# EAGLE design Qwiic_Spectral_Sensor-AS7265x-BottomJig (EAGLE 9.2.1)
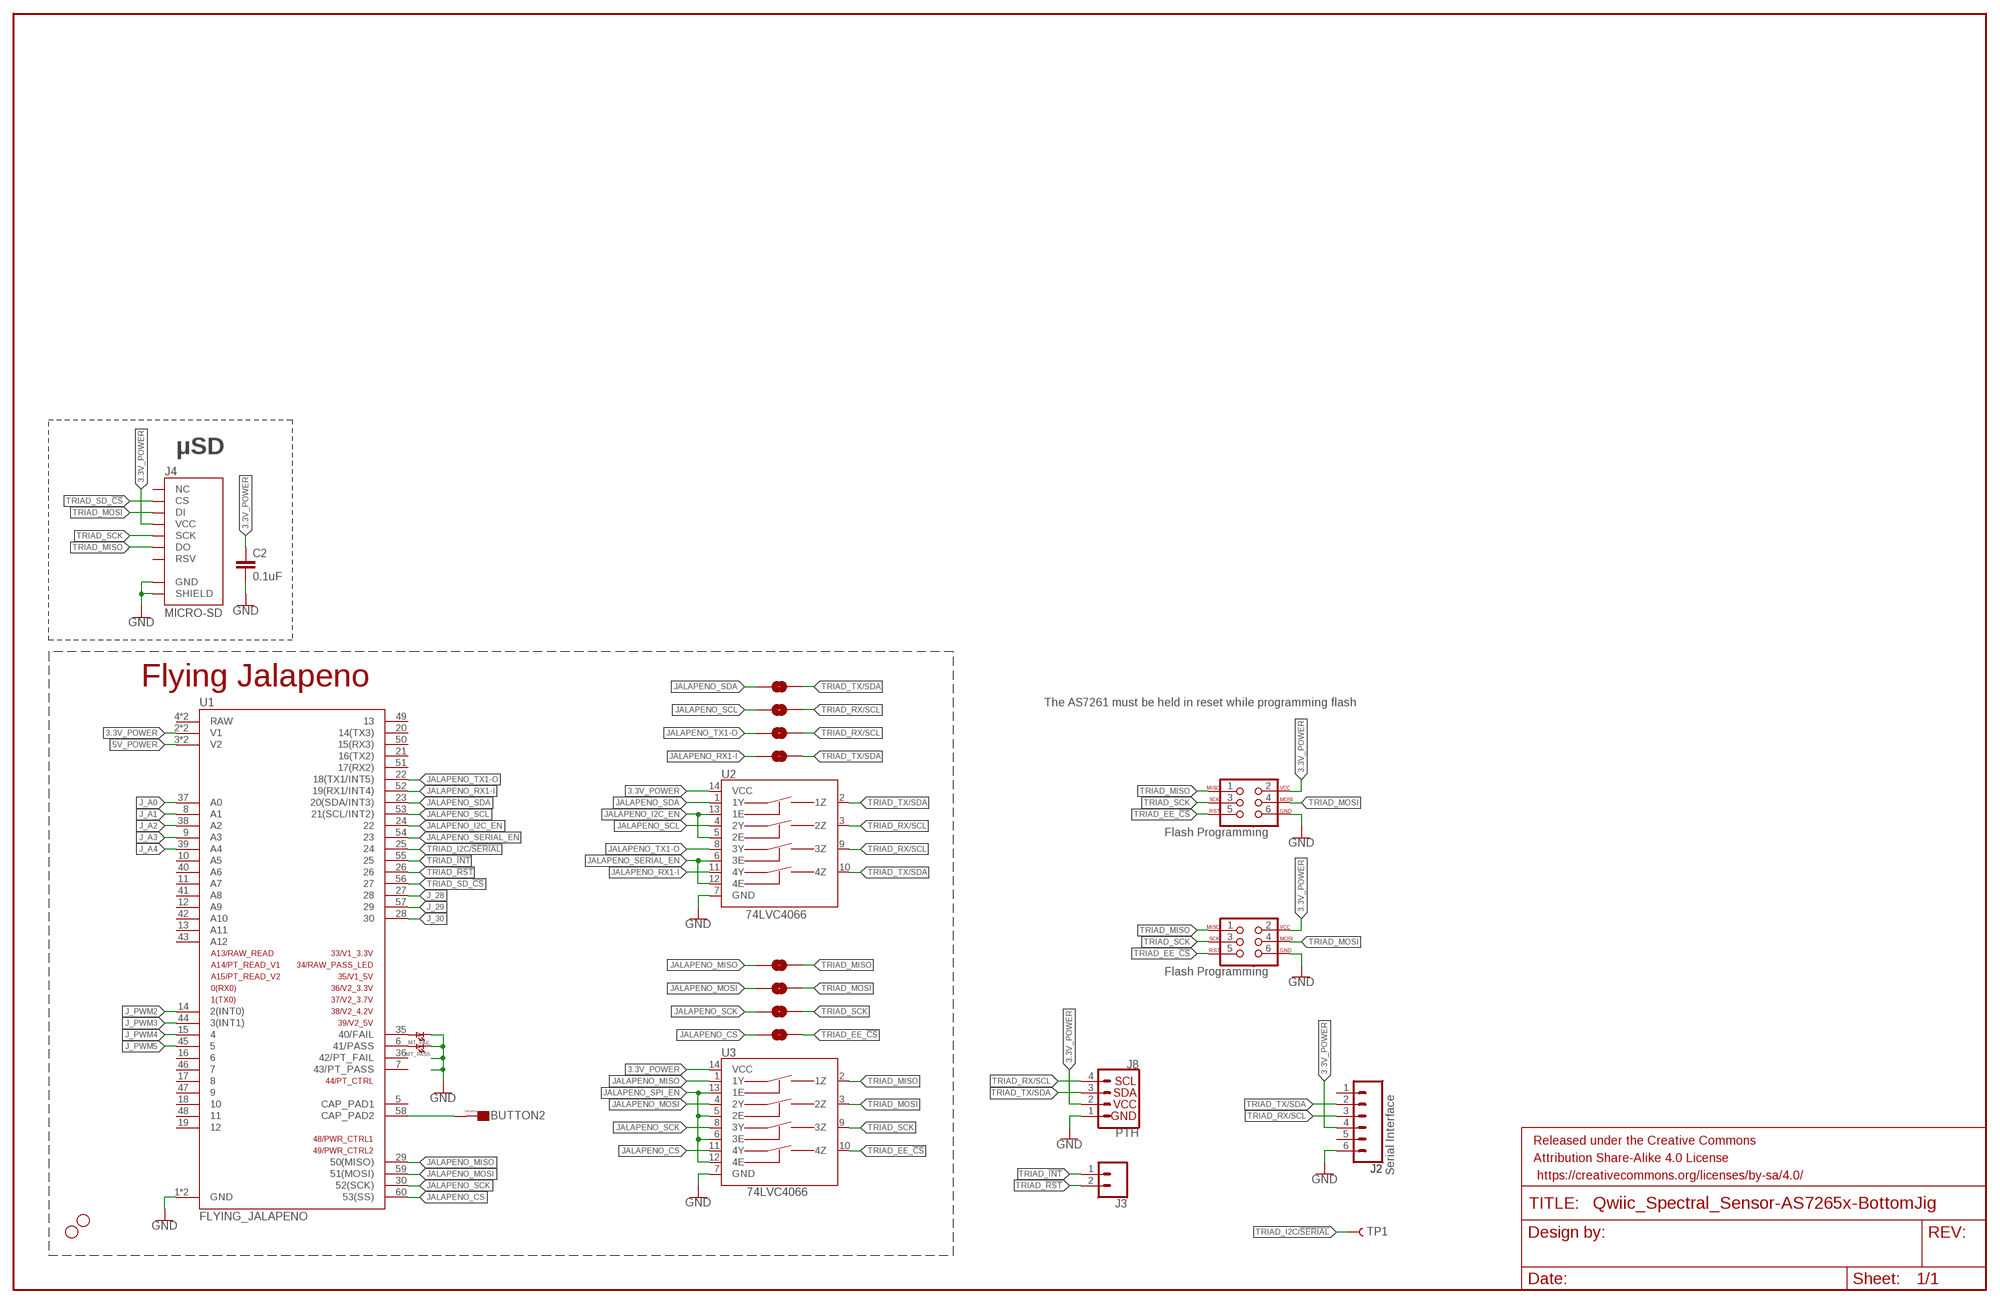
[diagram p0: schematic, sheet 1]

## Parts
BUTTON2  CAPSENSE_BUTTON_PAD_ONLY  [CAPSENSE_BUTTON_PADS_ONLY]
C2  0.1uF  0.1UF-0603-25V-(+80/-20%)  [0603]
FRAME2  FRAME-LEDGER  [CREATIVE_COMMONS]
H1  STAND-OFF  [STAND-OFF]
H3  STAND-OFF  [STAND-OFF]
J1  Flash Programming  AVR_SPI_PROG_3X2NS  [2X3-NS]
J2  Serial Interface  CONN_06NO_SILK_FEMALE_PTH  [1X06_NO_SILK]
J3  CONN_021X02_NO_SILK  [1X02_NO_SILK]
J4  MICRO-SD  MICRO-SD_CARD_SOCKETPUSH-PUSH  [MICRO-SD-SOCKET]
J5  Flash Programming  AVR_SPI_PROG_3X2NS  [2X3-NS]
J8  PTH  I2C_STANDARD_NO_SILK  [1X04_NO_SILK]
J_SCL  JUMPER-SMT_2_NO_NO-SILK  [SMT-JUMPER_2_NO_NO-SILK]
J_SCL1  JUMPER-SMT_2_NO_NO-SILK  [SMT-JUMPER_2_NO_NO-SILK]
J_SCL2  JUMPER-SMT_2_NO_NO-SILK  [SMT-JUMPER_2_NO_NO-SILK]
J_SCL3  JUMPER-SMT_2_NO_NO-SILK  [SMT-JUMPER_2_NO_NO-SILK]
J_SCL4  JUMPER-SMT_2_NO_NO-SILK  [SMT-JUMPER_2_NO_NO-SILK]
J_SCL5  JUMPER-SMT_2_NO_NO-SILK  [SMT-JUMPER_2_NO_NO-SILK]
J_SDA  JUMPER-SMT_2_NO_NO-SILK  [SMT-JUMPER_2_NO_NO-SILK]
J_SDA1  JUMPER-SMT_2_NO_NO-SILK  [SMT-JUMPER_2_NO_NO-SILK]
MT_FAIL  LED1206  [LED-1206]
MT_PASS  LED1206  [LED-1206]
TP1  TEST-POINTPOGO_PTH  [1X01_NO_SILK]
U1  FLYING_JALAPENO  FLYING_JALAPENO_V3MALE  [FLYING_JALAPENO_V3_M]
U2  74LVC4066  74LVC4066_MUX_1:1_X4  [SO14]
U3  74LVC4066  74LVC4066_MUX_1:1_X4  [SO14]

## Nets
3.3V_POWER [VCC]: C2.1 J1.2 J2.4 J4.VCC J5.2 J8.2 U1.2(V1) U1.32(V1) U2.14(VCC) U3.14(VCC)
5V_POWER [POWA]: U1.3(V2) U1.33(V2)
BUTTON2 [CAPSENSE]: BUTTON2.CAPSENSE_PAD(CAPSENSE) U1.58(CAP_PAD2)
GND: C2.2 J1.6 J2.6 J4.CD1(SHIELD) J4.GND J5.6 J8.1 MT_FAIL.C MT_PASS.C U1.1(GND) U1.31(GND) U2.7(GND) U3.7(GND)
J_28: U1.27
J_29: U1.57
J_30: U1.28
J_A0: U1.37(A0)
J_A1: U1.8(A1)
J_A2: U1.38(A2)
J_A3: U1.9(A3)
J_A4: U1.39(A4)
J_PWM2: U1.14(2(INT0))
J_PWM3: U1.44(3(INT1))
J_PWM4: U1.15
J_PWM5: U1.45
JALAPENO_CS: J_SDA1.1 U1.60(53(SS)) U3.11(4Y)
JALAPENO_I2C_EN: U1.24 U2.5(2E) U2.13(1E)
JALAPENO_MISO: J_SCL5.1 U1.29(50(MISO)) U3.1(1Y)
JALAPENO_MOSI: J_SCL3.1 U1.59(51(MOSI)) U3.4(2Y)
JALAPENO_RX1-I: J_SDA.1 U1.52(19(RX1/INT4)) U2.11(4Y)
JALAPENO_SCK: J_SCL4.1 U1.30(52(SCK)) U3.8(3Y)
JALAPENO_SCL: J_SCL.1 U1.53(21(SCL/INT2)) U2.4(2Y)
JALAPENO_SDA: J_SCL2.1 U1.23(20(SDA/INT3)) U2.1(1Y)
JALAPENO_SERIAL_EN: U1.54 U2.6(3E) U2.12(4E)
JALAPENO_SPI_EN: U3.5(2E) U3.6(3E) U3.12(4E) U3.13(1E)
JALAPENO_TX1-O: J_SCL1.1 U1.22(18(TX1/INT5)) U2.8(3Y)
N$15: MT_PASS.A U1.6(41/PASS)
N$16: MT_FAIL.A U1.35(40/FAIL)
TRIAD_!INT!: J3.1 U1.55
TRIAD_!RST!: J3.2 U1.26
TRIAD_EE_!CS!: J1.5 J5.5 J_SDA1.2 U3.10(4Z)
TRIAD_I2C/!SERIAL!: TP1.1 U1.25
TRIAD_MISO: J1.1 J4.DO J5.1 J_SCL5.2 U3.2(1Z)
TRIAD_MOSI: J1.4 J4.DI J5.4 J_SCL3.2 U3.3(2Z)
TRIAD_RX/SCL: J2.3 J8.4 J_SCL1.2 J_SCL.2 U2.3(2Z) U2.9(3Z)
TRIAD_SCK: J1.3 J4.SCLK(SCK) J5.3 J_SCL4.2 U3.9(3Z)
TRIAD_SD_!CS!: J4.CS U1.56
TRIAD_TX/SDA: J2.2 J8.3 J_SCL2.2 J_SDA.2 U2.2(1Z) U2.10(4Z)
Unconnected: J2.1 J2.5 J4.RSV1(RSV) J4.RSV2(NC) U1.4(RAW) U1.5(CAP_PAD1) U1.7(43/PT_PASS) U1.10(A5) U1.11(A7) U1.12(A9) U1.13(A11) U1.16 U1.17 U1.18 U1.19 U1.20(14(TX3)) U1.21(16(TX2)) U1.34(RAW) U1.36(42/PT_FAIL) U1.40(A6) U1.41(A8) U1.42(A10) U1.43(A12) U1.46 U1.47 U1.48 U1.49 U1.50(15(RX3)) U1.51(17(RX2))

## Notes on the sheet
- μSD
- Flying Jalapeno
- The AS7261 must be held in reset while programming flash

## Library data of the parts
BUTTON2 = Testing:CAPSENSE_BUTTON_PAD_ONLY
C2 = SparkFun-Capacitors:0.1UF: 0.1µF ceramic capacitors A capacitor is a passive two-terminal electrical component used to store electrical energy temporarily in an electric field.; PROD_ID: CAP-00810
FRAME2 = SparkFun-Aesthetics:FRAME-LEDGER: Schematic Frame - Ledger Standard 11x14 US Ledger frame
H1 H3 = SparkFun-Hardware:STAND-OFF: Stand Off Drill holes for mechanically mounting via screws, standoffs, etc. Note: Use the keepout ring to avoid running the screw head into surrounding components. Variant Overviews STAND-OFF - Mechanical footprint for a #4 phillips button head screw. STAND-OFF-TIGHT - Mechanical footprint for a #4 phillips button head screw, Example SparkFun Products Screw - Phillips Head (1/4", 4-40, 10 pack) <https://www.sparkfun.com/products/10453> (PRT-10453) Screw - Phillips Head (1/2", 4-40, 10 pack) <https://www.sparkfun.com/products/10452> (PRT-10452) Screw - Phillips Head (3/4", 4-40, 10 pack) <https://www.sparkfun.com/products/10451> (PRT-10451) Screw - Phillips Head (1", 4-40, 10 pack) <https://www.sparkfun.com/products/10450> (PRT-10450)
J1 J5 = SparkFun-Connectors:AVR_SPI_PROG_3X2: AVR ISP 6 Pin This is the reduced ISP connector for AVR programming. Common on Arduino. This footprint will take up less PCB space and can be used with a 10-pin to 6-pin adapter such as SKU: BOB-08508 **Special note about "TEST_POINT" package. The stop mask is on the top side, so if you want your programming test points to be on the bottom of your board, make sure to place this package on the bottom side of the board. This also ensure that the orientation to program from the bottom side will be correct. SparkFun Products: SparkFun ISP Pogo Adapter <https://www.sparkfun.com/products/11591> - NS Tiny AVR Programmer <https://www.sparkfun.com/products/11801> -PTH
J2 = SparkFun-Connectors:CONN_06: Multi connection point. Often used as Generic Header-pin footprint for 0.1 inch spaced/style header connections On any of the 0.1 inch spaced packages, you can populate with these: Break Away Headers - Straight <https://www.sparkfun.com/products/116> (PRT-00116) Break Away Male Headers - Right Angle <https://www.sparkfun.com/products/553> (PRT-00553) Female Headers <https://www.sparkfun.com/products/115> (PRT-00115) Break Away Headers - Machine Pin <https://www.sparkfun.com/products/117> (PRT-00117) Break Away Female Headers - Swiss Machine Pin <https://www.sparkfun.com/products/743> (PRT-00743) Arduino Stackable Header - 6 Pin <https://www.sparkfun.com/products/9280> (PRT-09280) For SCREWTERMINALS and SPRING TERMINALS visit here: Screw Terimnals on SparkFun.com <https://www.sparkfun.com/search/results?term=Screw+Terminals> (5mm/3.5mm/2.54mm spacing) This device is also useful as a general connection point to wire up your design to another part of your project. Our various solder wires solder well into these plated through hole pads. Hook-Up Wire - Assortment (Stranded, 22 AWG) <https://www.sparkfun.com/products/11375> (PRT-11375) Hook-Up Wire - Assortment (Solid Core, 22 AWG) <https://www.sparkfun.com/products/11367> (PRT-11367) View the entire wire category on our website here <https://www.sparkfun.com/categories/141>; PROD_ID: CONN-08437
J3 = SparkFun-Connectors:CONN_02: Multi connection point. Often used as Generic Header-pin footprint for 0.1 inch spaced/style header connections On any of the 0.1 inch spaced packages, you can populate with these: Break Away Headers - Straight <https://www.sparkfun.com/products/116> (PRT-00116) Break Away Male Headers - Right Angle <https://www.sparkfun.com/products/553> (PRT-00553) Female Headers <https://www.sparkfun.com/products/115> (PRT-00115) Break Away Headers - Machine Pin <https://www.sparkfun.com/products/117> (PRT-00117) Break Away Female Headers - Swiss Machine Pin <https://www.sparkfun.com/products/743> (PRT-00743) For SCREWTERMINALS and SPRING TERMINALS visit here: Screw Terimnals on SparkFun.com <https://www.sparkfun.com/search/results?term=Screw+Terminals> (5mm/3.5mm/2.54mm spacing) This device is also useful as a general connection point to wire up your design to another part of your project. Our various solder wires solder well into these plated through hole pads. Hook-Up Wire - Assortment (Stranded, 22 AWG) <https://www.sparkfun.com/products/11375> (PRT-11375) Hook-Up Wire - Assortment (Solid Core, 22 AWG) <https://www.sparkfun.com/products/11367> (PRT-11367) View the entire wire category on our website here <https://www.sparkfun.com/categories/141> Special notes: Molex polarized connector foot print use with: PRT-08233 with associated crimp pins and housings. 2.54_SCREWTERM for use with PRT-10571. 3.5mm Screw Terminal footprints for PRT-08084 5mm Screw Terminal footprints for use with PRT-08432
J4 = SparkFun-Connectors:MICRO-SD_CARD_SOCKET: microSD Socket for Transflash Push-push type µSD socket. tDoc lines correctly indicate media card edge positions when inserting (unlocked, locked, depressed). NOTE: CD1 and CD2 are connected internally, and the default detect state of the socket is detect pin to ground. SparkFun Products: WAV Trigger <https://www.sparkfun.com/products/13660> CAN-Bus Shield <https://www.sparkfun.com/products/13262> SparkFun Level Shifing microSD Breakout <https://www.sparkfun.com/products/13743>; PROD_ID: CONN-07820
J8 = SparkFun-Connectors:I2C_STANDARD: SparkFun I2C Standard Pinout Header SparkFun has standardized on a pinout for all I2C based sensor breakouts. This pinout allows I2C boards to be plugged directly into the headers on Arduino Uno compatible boards, and to be daisy chained easily. Example SparkFun Products: SparkFun Atmospheric Sensor Breakout - BME280 <https://www.sparkfun.com/products/13676> SparkFun Altitude/Pressure Sensor Breakout - MPL3115A2 <https://www.sparkfun.com/products/11084> SparkFun TOF Range Finder Sensor - VL6180 <https://www.sparkfun.com/products/12785>
J_SCL J_SCL1-J_SCL5 J_SDA J_SDA1 = SparkFun-Jumpers:JUMPER-SMT_2_NO: Normally open jumper This jumper has two pads in close proximity to each other. Apply solder to close the connection. Round pads are easier to solder for beginners, but are a lot larger. SparkFun Product that uses the round pads: SparkFun EL Sequencer <https://www.sparkfun.com/products/12781>
MT_FAIL MT_PASS = Testing:LED: LEDs Standard schematic elements and footprints for 5mm, 3mm, 1206, and 0603 sized LEDs. 5mm - Spark Fun Electronics SKU : COM-00529 (and others)
TP1 = SparkFun-Connectors:TEST-POINT: SparkFun Test Points Bare copper test points for troubleshooting or In-Circuit-Testing. These are used by our Production team for verifying production board runs using pogo-pins on test beds. SparkFun Products: SparkFun LSM9DS1 Breakout <https://www.sparkfun.com/products/13284> SparkFun PSOC <https://www.sparkfun.com/products/13714> SparkFun Load Cell Amplifier <https://www.sparkfun.com/products/13879>
U1 = Testing:FLYING_JALAPENO_V3
U2 U3 = Testing:74LVC4066_MUX_1:1_X4

## Net classes
1 VCC: width 0.381 mm
2 POWA: width 0.61 mm
3 CAPSENSE: width 0.508 mm

## Board
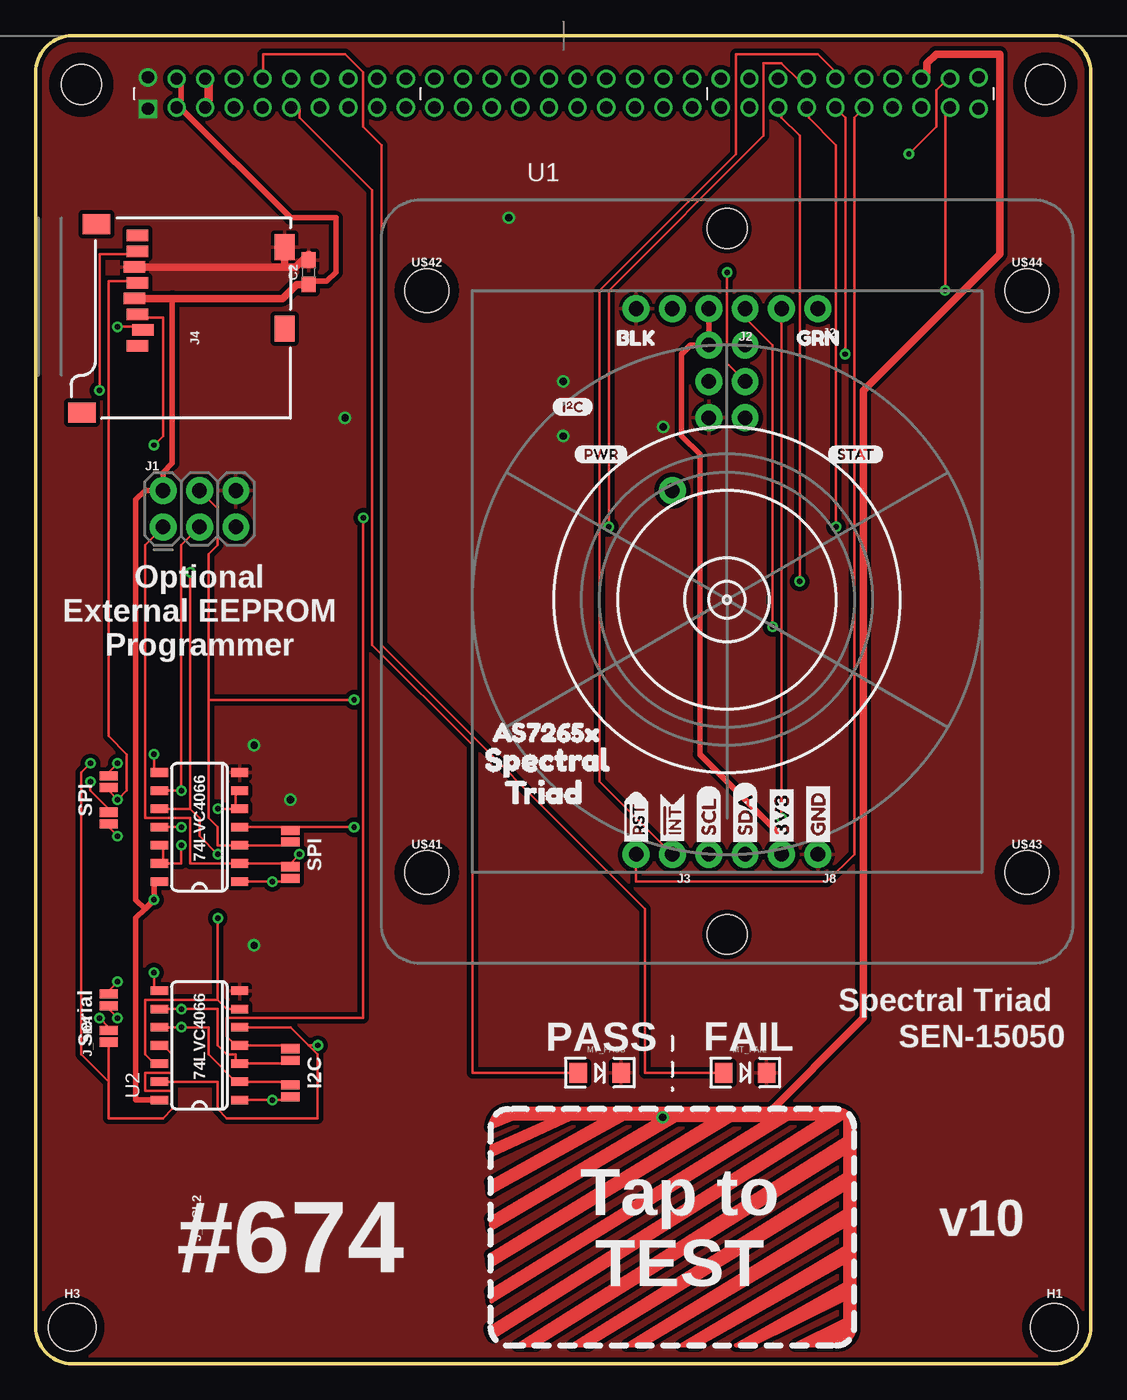
[diagram p1: board, top side]
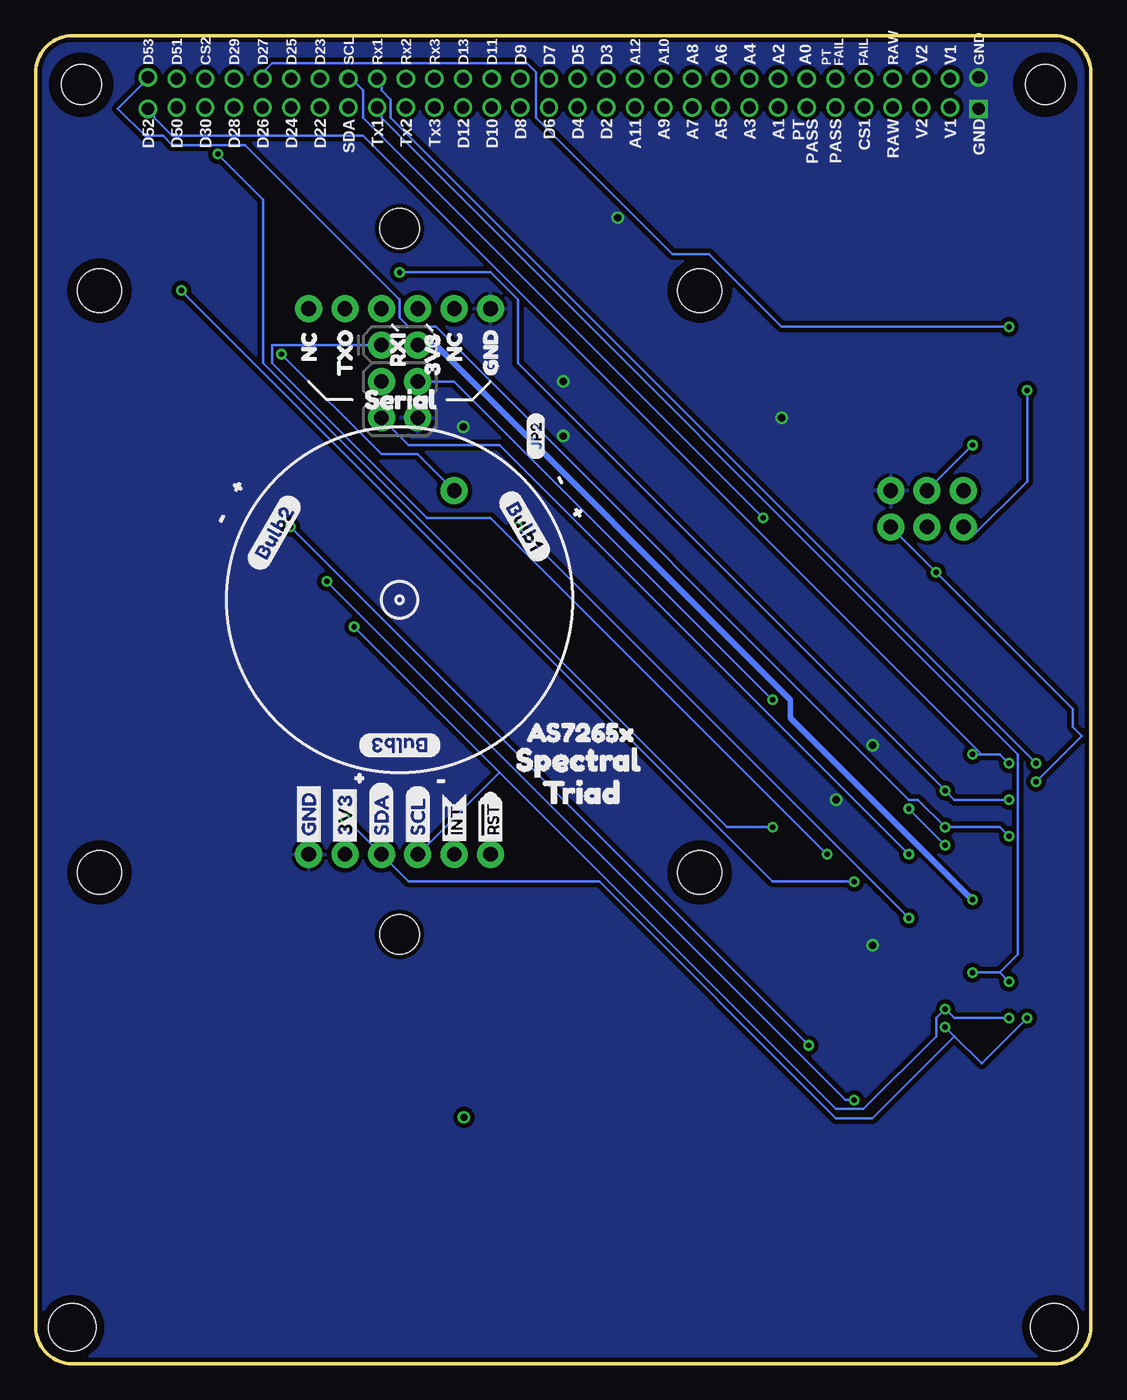
[diagram p2: board, bottom side, seen from below]

Size 73.66 x 92.71 mm. Coordinates in mm from the lower left corner, seen from the top.
Outline: 2.54,92.71 71.12,92.71 arc-90 73.66,90.17 73.66,2.54 arc-90 71.12,0 2.54,0 arc-90 0,2.54 0,90.17 arc-90 2.54,92.71
Copper layers (1*16): Top 0.035mm / dielectric 1.5mm / Bottom 0.035mm
Design rules "SparkFun-2-layer-TIGHT": minimum track width 7mil, minimum drill 15mil, track to track 7mil, track to pad 7mil, pad to pad 7mil, via to via 7mil, smd to smd 7mil, copper to edge 7mil, drill to drill 7mil, minimum pad ring 7mil, minimum via ring 7mil, stop-mask expansion 4mil, vias tented up to drill 25mil, thermal gap 10mil

### Footprints (pad centres in the part's own frame; a part is rotated, then mirrored left to right if it is on the bottom)
CAPSENSE_BUTTON_PADS_ONLY = drill 0.508: CAPSENSE_PAD -0.686,7.036
0603 = smd 1.1 x 1: 1 -0.85,0; 2 0.85,0
STAND-OFF = hole 3.302: 0,0
2X3-NS = drill 1.016 pad 1.88: 1 -2.54,-1.27; 2 -2.54,1.27; 3 0,-1.27; 4 0,1.27; 5 2.54,-1.27; 6 2.54,1.27
1X06_NO_SILK = drill 1.016 pad 1.88: 1 0,0; 2 2.54,0; 3 5.08,0; 4 7.62,0; 5 10.16,0; 6 12.7,0
1X02_NO_SILK = drill 1.016 pad 1.88: 1 0,0; 2 2.54,0
MICRO-SD-SOCKET = smd 1.8 x 1.4: CD1 -2.05,0.4; CD2 -7.75,0.4 | smd 0.8 x 1.5: CS -7.84,10.3; DI -6.74,10.7; DO -2.34,10.7; GND -3.44,10.9; RSV1 -8.94,10.7; RSV2 -1.24,10.7; SCLK -4.54,10.7; VCC -5.64,10.9 | smd 1.4 x 1.9: GND1 -13.6,14.55; GND3 -0.45,13.55
1X04_NO_SILK = drill 1.016 pad 1.88: 1 0,0; 2 2.54,0; 3 5.08,0; 4 7.62,0
SMT-JUMPER_2_NO_NO-SILK = smd 0.635 x 1.27: 1 -0.406,0; 2 0.406,0
LED-1206 = smd 1.2 x 1.4: A -1.5,0; C 1.5,0
1X01_NO_SILK = drill 1.016 pad 1.88: 1 0,0
FLYING_JALAPENO_V3_M = drill 0.85 square: 1 -29,-5.1 | drill 0.85: 2 -27,-5; 3 -25,-5; 4 -23,-5; 5 -21,-5; 6 -19,-5; 7 -17,-5; 8 -15,-5; 9 -13,-5; 10 -11,-5; 11 -9,-5; 12 -7,-5; 13 -5,-5; 14 -3,-5; 15 -1,-5; 16 1,-5; 17 3,-5; 18 5,-5; 19 7,-5; 20 9,-5; 21 11,-5; 22 13,-5; 23 15,-5; 24 17,-5; 25 19,-5; 26 21,-5; 27 23,-5; 28 25,-5; 29 27,-5; 30 29,-5.1; 31 -29,-2.9; 32 -27,-3; 33 -25,-3; 34 -23,-3; 35 -21,-3; 36 -19,-3; 37 -17,-3; 38 -15,-3; 39 -13,-3; 40 -11,-3; 41 -9,-3; 42 -7,-3; 43 -5,-3; 44 -3,-3; 45 -1,-3; 46 1,-3; 47 3,-3; 48 5,-3; 49 7,-3; 50 9,-3; 51 11,-3; 52 13,-3; 53 15,-3; 54 17,-3; 55 19,-3; 56 21,-3; 57 23,-3; 58 25,-3; 59 27,-3; 60 29,-2.9 | hole 2.794: 33.655,-3.404; -33.655,-3.404
SO14 = smd 0.6 x 1.2: 1 -3.175,-2.8; 2 -1.905,-2.8; 3 -0.635,-2.8; 4 0.635,-2.8; 5 1.905,-2.8; 6 3.175,-2.8; 7 4.445,-2.8; 8 4.445,2.8; 9 3.175,2.8; 10 1.905,2.8; 11 0.635,2.8; 12 -0.635,2.8; 13 -1.905,2.8; 14 -3.175,2.8
STAND-OFF-TIGHT = hole 3.048: 0,0
NUBBIN_LOCKER = hole 2.794: 0,0

### Placement (x,y rotation side)
BUTTON2  44.45,10.16 0 top
C2  19.05,76.2 90 top
FRAME2  -11.43,-39.37 0 top  (outside the outline)
H1  71.12,2.54 0 top
H3  2.54,2.54 0 top
J1  11.43,59.69 0 top
J2  54.61,73.66 180 top
J3  44.45,35.56 180 top
J4  17.78,80.01 90 top
J5  48.26,68.58 270 bottom
J8  54.61,35.56 180 top
J_SCL  17.78,21.59 270 top
J_SCL1  5.08,25.4 270 top
J_SCL2  17.78,19.05 90 top
J_SCL3  17.78,36.83 270 top
J_SCL4  5.08,40.64 270 top
J_SCL5  17.78,34.29 90 top
J_SDA  5.08,22.86 90 top
J_SDA1  5.08,38.1 90 top
MT_FAIL  49.53,20.32 0 top
MT_PASS  39.37,20.32 0 top
TP1  44.45,60.96 0 bottom
U1  36.83,92.71 0 top
U2  11.43,21.59 90 top
U3  11.43,36.83 90 top
U$1  [#0]  60.33,60.2 60 bottom
U$2  [I_SUPER2_C-()-03]  36.07,66.8 0 top
U$3  [PWR-()-03]  37.59,63.5 0 top
U$4  [AS7265X0]  30.73,44.07 0 top
U$5  [BULB15]  40.89,60.83 300 bottom
U$6  [BULB26]  58.55,55.37 60 bottom
U$7  [BULB37]  45.34,43.18 180 bottom
U$8  [JP20]  38.73,63.12 90 bottom
U$9  [SPECTRAL1]  29.97,42.16 0 top
U$10  [STAT4]  55.24,63.5 0 top
U$11  [TRIAD2]  31.37,39.88 0 top
U$12  [TRIAD2]  39.62,39.88 0 bottom
U$13  [SPECTRAL1]  41.53,42.16 0 bottom
U$14  [AS7265X0]  40.51,44.07 0 bottom
U$15  [3V33]  45.97,67.94 90 bottom
U$16  [BLK7]  39.62,71.63 0 top
U$17  [GND5]  41.91,68.2 90 bottom
U$18  [GRN6]  52.07,71.63 0 top
U$19  [NC4]  54.61,69.09 90 bottom
U$20  [NC4]  44.45,69.09 90 bottom
U$21  [RXI2]  48.39,68.71 90 bottom
U$22  [SERIAL0]  51.82,67.31 0 bottom
U$23  [TXO1]  52.07,68.07 90 bottom
U$24  [3V3-04]  52.07,35.94 90 bottom
U$25  [GND-04]  54.61,35.94 90 bottom
U$26  [SDA-[)]  49.53,35.94 90 bottom
U$27  [SCL-[)]  46.99,35.94 90 bottom
U$28  [INT#-[<-04]  44.45,35.81 90 bottom
U$29  [RST#-[>-04]  41.91,35.81 90 bottom
U$30  [GND-04]  54.61,35.94 90 top
U$31  [3V3-04]  52.07,35.94 90 top
U$32  [SDA-[)]  49.53,35.94 90 top
U$33  [SCL-[)]  46.99,35.94 90 top
U$34  [INT#-[<-04]  44.45,35.81 90 top
U$35  [RST#-[>-04]  41.91,35.81 90 top
U$36  [#0]  36.32,60.58 300 bottom
U$37  [#0]  52.32,41.02 0 bottom
U$38  [#1]  46.61,40.89 0 bottom
U$39  [#1]  37.47,62.87 300 bottom
U$40  [#1]  61.47,58.04 60 bottom
U$41  [STAND-OFF-TIGHT]  27.31,34.29 0 top
U$42  [STAND-OFF-TIGHT]  27.31,74.93 0 top
U$43  [STAND-OFF-TIGHT]  69.21,34.29 0 top
U$44  [STAND-OFF-TIGHT]  69.21,74.93 0 top
U$45  [NUBBIN_LOCKER]  48.26,29.97 0 top
U$46  [NUBBIN_LOCKER]  48.26,79.25 0 top

### Tracks (layer width: path | path; a pad name or v marks a point on that pad's centre or on a via)
3.3V_POWER  (via drill 0.38)
  Top 0.381: J5.2 46.99,73.03 J2.4 | J5.2 45.72,71.12 45.09,70.48 45.09,64.77 46.35,63.5 46.35,42.55 52.07,36.83 52.07,36.2 J8.2 | J5.2 | U2.14 6.99,18.41 6.99,31.11 7.62,31.75 | 7.62,31.75 v8.26,32.38 8.26,33.66 U3.14 | U1.32 10.16,89.53 10.16,88.27 U1.2 10.16,87.63 17.78,80.01 20.95,80.01 20.95,76.2 20.32,75.56 19.05,75.56 C2.1 | 9.53,74.37 9.53,62.87 8.89,62.23 J1.2 7.62,60.96 6.99,60.33 6.99,32.38 7.62,31.75
  Top 0.508: J4.VCC 9.53,74.37 17.22,74.37 18.2,75.35 C2.1
  Bottom 0.381: J5.2 45.72,71.12 20.95,46.35 20.95,45.09 v8.26,32.38 | J5.2
5V_POWER
  Top 0.61: U1.3 12.06,88.27 12.06,89.53 U1.33
BUTTON2
  Top 0.508: U1.58 62.23,90.17 62.23,90.81 62.87,91.44 67.31,91.44 67.31,77.47 57.78,67.94 57.78,24.13 50.8,17.14 43.81,17.14 BUTTON2.CAPSENSE_PAD
GND  (via drill 0.51)
  Top 0.152: 17.38,76.59 17.4,76.57
  Top 0.508: J4.GND 17.4,76.57 18.15,76.57 19.05,77.47 C2.2 | J4.CD1 17.38,76.59
  other vias: 21.59,66.04 33.02,80.01 36.83,68.58 36.83,64.77 15.24,43.18 17.78,39.37 15.24,29.21 43.81,65.41
  pour Top (isolate 0.305): 0,92.71 73.66,92.71 73.66,0 0,0
  pour Bottom (isolate 0.305): 0,92.71 73.66,92.71 73.66,0 0,0
JALAPENO_CS  (via drill 0.38)
  Top 0.178: v10.16,37.47 U3.11 | v5.71,36.83 5.08,37.47 J_SDA1.1
  Bottom 0.178: v5.71,36.83 6.35,37.47 v10.16,37.47 12.06,39.37 12.7,39.37 45.72,72.39 47.62,72.39 48.26,73.03 48.26,74.3 59.05,85.09 64.14,85.09 64.77,85.72 66.04,85.72 67.94,87.63 66.04,89.53 U1.60
JALAPENO_I2C_EN  (via drill 0.38)
  Top 0.178: U2.13 12.7,19.68 12.7,17.78 13.34,17.14 19.68,17.14 19.68,21.59 19.05,22.23 | 19.05,22.23 17.78,23.5 U2.5 | v55.88,58.42 55.88,85.09 53.98,87 53.98,87.63 U1.24 | 19.05,22.23 v19.68,22.23
  Bottom 0.178: v19.68,22.23 v55.88,58.42
JALAPENO_MISO  (via drill 0.38)
  Top 0.178: U3.1 v16.51,33.66 17.78,33.66 J_SCL5.1 | v63.5,74.93 63.5,87.63 U1.29
  Bottom 0.178: v16.51,33.66 22.23,33.66 v63.5,74.93
JALAPENO_MOSI  (via drill 0.38)
  Top 0.178: 17.78,37.47 U3.4 | v22.23,37.47 17.78,37.47 | v60.96,84.45 62.87,86.36 62.87,88.9 63.5,89.53 U1.59 | 17.78,37.47 J_SCL3.1
  Bottom 0.178: v22.23,37.47 25.4,37.47 57.78,69.85 57.78,81.28 v60.96,84.45
JALAPENO_RX1-I  (via drill 0.38)
  Top 0.178: J_SDA.1 5.08,19.68 | 5.08,19.68 5.08,17.14 8.89,17.14 9.53,17.78 9.53,19.05 7.62,19.05 7.62,20.32 9.53,20.32 9.53,21.59 8.89,22.23 U2.11 | v3.81,41.91 3.17,41.27 3.17,21.59 5.08,19.68
  Bottom 0.178: v3.81,41.91 48.9,87 48.9,88.27 49.53,88.9 49.53,89.53 U1.52
JALAPENO_SCK  (via drill 0.38)
  Top 0.178: v8.26,42.55 8.26,41.27 U3.8 | v5.71,41.91 5.08,41.27 J_SCL4.1
  Bottom 0.178: 7.62,42.55 6.35,42.55 v5.71,41.91 | 7.62,42.55 v8.26,42.55 | 7.62,42.55 50.8,85.72 64.14,85.72 65.41,87 65.41,87.63 U1.30
JALAPENO_SCL  (via drill 0.38)
  Top 0.178: J_SCL.1 17.78,22.23 U2.4 13.97,22.23 13.34,22.86 13.34,24.13 22.86,24.13 v22.86,59.05
  Bottom 0.178: v22.86,59.05 50.8,87 50.8,88.9 51.44,89.53 U1.53
JALAPENO_SDA  (via drill 0.38)
  Top 0.178: U2.1 v16.51,18.41 17.78,18.41 J_SCL2.1 | v53.34,54.61 53.34,85.72 52.07,87 52.07,87.63 U1.23
  Bottom 0.178: v16.51,18.41 17.14,18.41 v53.34,54.61
JALAPENO_SERIAL_EN  (via drill 0.38)
  Top 0.178: 12.7,25.4 7.62,25.4 7.62,21.59 8.26,20.95 U2.12 | 12.7,25.4 13.34,24.77 U2.6 | v40.01,58.42 40.01,74.93 50.8,85.72 50.8,90.81 52.07,90.81 53.34,89.53 U1.54 | 12.7,25.4 v12.7,31.11
  Bottom 0.178: v12.7,31.11 v40.01,58.42
JALAPENO_SPI_EN  (via drill 0.38)
  Top 0.178: 8.89,34.92 8.89,36.2 U3.12 | 13.97,38.73 13.97,40.01 U3.6 | 8.89,34.92 10.16,34.92 v10.16,36.2 | 13.97,38.73 v12.7,38.73 | 8.89,34.92 U3.13 | 13.97,38.73 U3.5
  Bottom 0.178: v12.7,38.73 v10.16,36.2
JALAPENO_TX1-O  (via drill 0.38)
  Top 0.178: v8.26,27.3 8.26,26.04 U2.8 | v5.71,26.67 5.08,26.04 J_SCL1.1
  Bottom 0.178: 6.35,27.3 v8.26,27.3 | v5.71,26.67 6.35,27.3 | 6.35,27.3 5.08,28.57 5.08,42.55 49.53,87 49.53,87.63 U1.22
N$15
  Top 0.178: MT_PASS.A 30.48,20.32 30.48,43.18 23.5,50.16 23.5,81.92 18.41,87 18.41,87.63 U1.6
N$16
  Top 0.178: MT_FAIL.A 42.55,20.32 42.55,31.75 24.13,50.16 24.13,85.09 22.86,86.36 22.86,90.17 21.59,91.44 15.88,91.44 15.88,90.17 U1.35
TRIAD_!INT!
  Top 0.178: J3.1 39.37,40.64 39.37,74.93 48.9,84.45 48.9,91.44 54.61,91.44 55.88,90.17 U1.55 | J3.1
TRIAD_!RST!
  Top 0.178: J3.2 41.91,33.66 55.24,33.66 57.15,35.56 57.15,87 57.78,87.63 U1.26 | J3.2
TRIAD_EE_!CS!  (via drill 0.38)
  Top 0.178: 10.79,38.73 U3.10 | v10.79,55.24 10.79,38.73 | v3.81,40.64 3.81,40.01 5.08,38.73 J_SDA1.2 | v12.7,35.56 11.43,36.83 11.43,38.1 10.79,38.73
  Bottom 0.178: J1.5 v10.79,55.24 1.27,45.72 1.27,44.45 0.64,43.81 v3.81,40.64 | v12.7,35.56 41.27,64.14 47.62,64.14 48.9,65.41 49.53,65.41 J5.5
TRIAD_I2C/!SERIAL!  (via drill 0.38)
  Top 0.178: v56.52,70.48 56.52,87 55.88,87.63 U1.25
  Bottom 0.178: v56.52,70.48 49.53,63.5 46.99,63.5 TP1.1
TRIAD_MISO  (via drill 0.38)
  Top 0.178: 17.78,34.92 U3.2 10.79,34.92 10.79,38.1 7.62,38.1 7.62,57.15 J1.1 | 17.78,34.92 v18.41,35.56 | 17.78,34.92 J_SCL5.2 | v4.45,67.94 4.45,77.47 6.99,77.47 J4.DO
  Bottom 0.178: J5.1 57.15,71.12 57.15,69.85 46.35,59.05 41.91,59.05 v18.41,35.56 | J5.1 | v4.45,67.94 4.45,61.59 8.26,57.78 J1.1
TRIAD_MOSI  (via drill 0.38)
  Top 0.178: J_SCL3.2 17.78,36.2 U3.3 12.7,36.2 12.7,37.47 12.06,38.1 12.06,46.35 | 12.06,46.35 12.06,56.52 12.7,57.15 12.7,59.69 J1.4 | 12.06,46.35 v22.23,46.35 | v8.26,64.14 8.89,64.77 8.89,73.03 7.62,73.03 J4.DI
  Bottom 0.178: J5.4 44.45,68.58 v22.23,46.35 | J5.4 | J1.4 v8.26,64.14
TRIAD_RX/SCL  (via drill 0.38)
  Top 0.178: J_SCL.2 17.78,20.95 U2.3 13.97,20.95 13.97,21.59 13.34,21.59 12.7,22.23 12.7,24.77 v10.16,24.77 U2.9 | v5.71,24.13 5.08,24.77 J_SCL1.2 | v51.44,51.44 51.44,71.12 49.53,73.03 J2.3
  Bottom 0.178: v5.71,24.13 9.53,24.13 v10.16,24.77 10.79,24.13 10.79,22.86 15.88,17.78 17.78,17.78 41.27,41.27 | 41.27,41.27 46.35,36.2 J8.4 | 41.27,41.27 v51.44,51.44
TRIAD_SCK  (via drill 0.38)
  Top 0.178: U3.9 v10.16,40.01 10.16,57.15 J1.3 | J_SCL4.2 5.08,40.01 v5.71,39.37 6.35,40.01 6.35,42.55 5.08,43.81 5.08,75.56 6.99,75.56 J4.SCLK | J5.3 48.26,69.85 v48.26,76.2 | J5.3
  Bottom 0.178: v5.71,39.37 9.53,39.37 v10.16,40.01 40.01,69.85 40.01,74.3 41.91,76.2 v48.26,76.2
TRIAD_SD_!CS!  (via drill 0.38)
  Top 0.178: v5.71,72.39 6.99,72.39 J4.CS
  Bottom 0.178: v5.71,72.39 21.59,72.39 26.67,77.47 29.21,77.47 38.73,87 38.73,90.17 39.37,90.81 57.15,90.81 57.78,90.17 U1.56
TRIAD_TX/SDA  (via drill 0.38)
  Top 0.178: J_SCL2.2 17.78,19.68 U2.2 13.97,19.68 12.06,21.59 12.06,23.5 v10.16,23.5 U2.10 | v4.45,24.13 5.08,23.5 J_SDA.2 | v52.07,38.1 52.07,73.03 J2.2
  Bottom 0.178: v4.45,24.13 7.62,20.95 9.53,22.86 | v10.16,23.5 9.53,22.86 | 9.53,22.86 15.24,17.14 17.78,17.14 34.29,33.66 47.62,33.66 48.9,34.92 48.9,35.56 J8.3 | J8.3 v52.07,38.1 | J8.3

### Text on the board
tPlace: Optional / External EEPROM / Programmer | SPI | SPI | Spectral Triad | Serial | PASS | FAIL | SEN-15050 | I2C | Tap to / TEST | v10 | #674
bPlace: GND
tDocu: Nathan Seidle